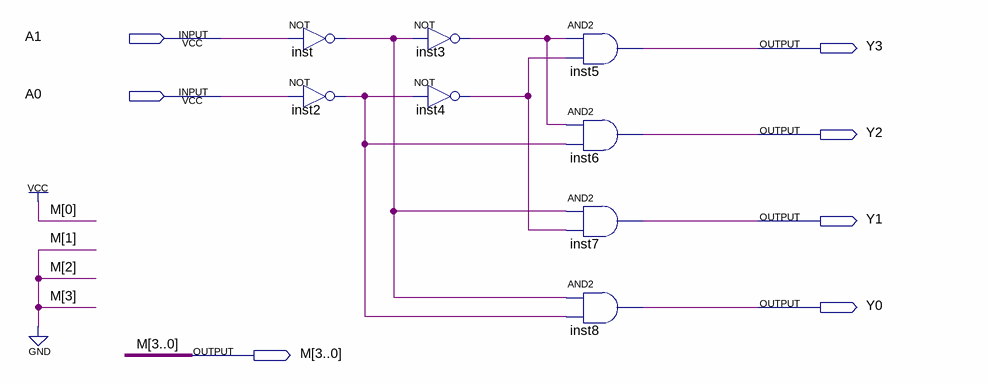
[diagram p0: schematic sheet]
// Quartus schematic shiyan_1.bdf as structural Verilog: 8 symbols, 7 pins
module shiyan_1 (
  input  A1,
  input  A0,
  output Y3,
  output Y2,
  output Y1,
  output Y0,
  output [3:0] M
);

  wire inst2_out, inst3_out, inst4_out, inst_out;

  not inst (inst_out, A1);
  not inst2 (inst2_out, A0);
  not inst3 (inst3_out, inst_out);
  not inst4 (inst4_out, inst2_out);
  and inst5 (Y3, inst3_out, inst4_out);
  and inst6 (Y2, inst3_out, inst2_out);
  and inst7 (Y1, inst_out, inst4_out);
  and inst8 (Y0, inst_out, inst2_out);

  assign M = 4'b0001;
endmodule
